# Altium schematic sheet 1 Power.SchDoc: Power
size A3; PageSetup: Record=PageOptions|CenterHorizontal=True|CenterVertical=True|PrintScale=1.01|XCorrection=1.00|YCorrection=1.00|PrintKind=2|BorderSize=5000000|LeftOffset=0|BottomOffset=0|Orientation=2|PaperLength=1000|PaperWidth=1000|Scale=100|PaperSource=15|PrintQuality=600|MediaType=1|DitherType=10|PaperKind=A3|PrintScaleMode=1; DocumentNumber: 4; SheetNumber: 2; SheetTotal: 7
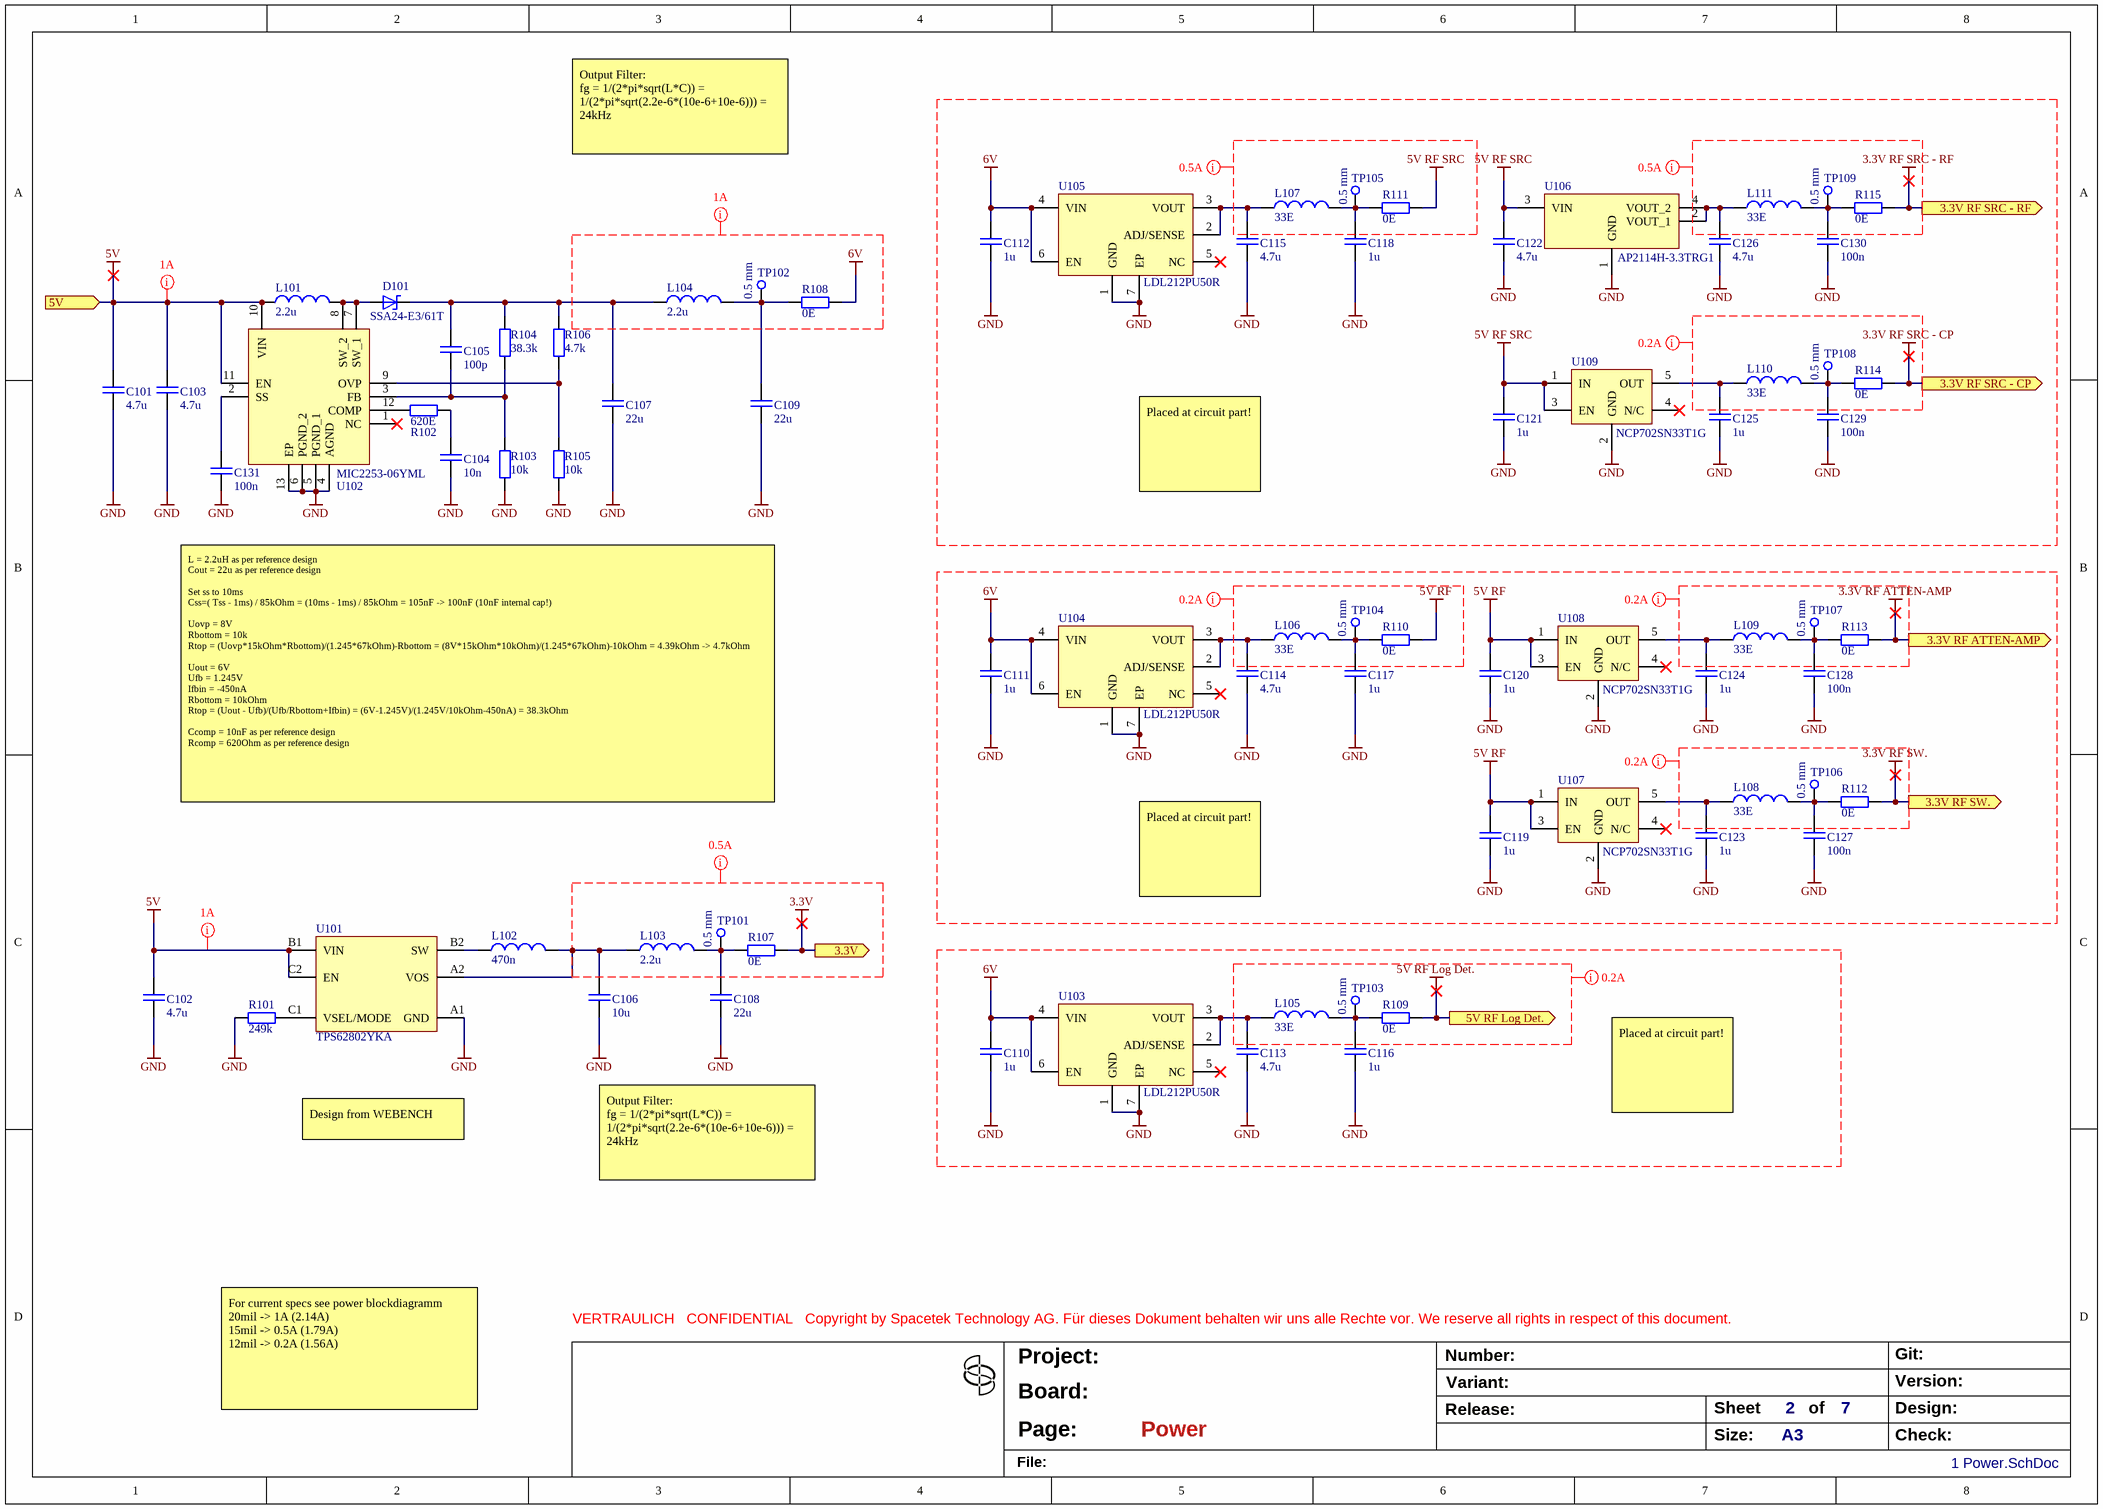
[diagram p0: 1 Power.SchDoc]

## Parts
C101  4.7u  [STT--CC--0805]
C102  4.7u  [STT--CC--0805]
C103  4.7u  [STT--CC--0805]
C104  10n  [STT--CC--0603]
C105  100p  [STT--CC--0402]
C106  10u  [STT--CC--0603]
C107  22u  [STT--CC--0805]
C108  22u  [STT--CC--0805]
C109  22u  [STT--CC--0805]
C110  1u  [STT--CC--0603]
C111  1u  [STT--CC--0603]
C112  1u  [STT--CC--0603]
C113  4.7u  [STT--CC--0805]
C114  4.7u  [STT--CC--0805]
C115  4.7u  [STT--CC--0805]
C116  1u  [STT--CC--0603]
C117  1u  [STT--CC--0603]
C118  1u  [STT--CC--0603]
C119  1u  [STT--CC--0603]
C120  1u  [STT--CC--0603]
C121  1u  [STT--CC--0603]
C122  4.7u  [STT--CC--0805]
C123  1u  [STT--CC--0603]
C124  1u  [STT--CC--0603]
C125  1u  [STT--CC--0603]
C126  4.7u  [STT--CC--0805]
C127  100n  [STT--CC--0402]
C128  100n  [STT--CC--0402]
C129  100n  [STT--CC--0402]
C130  100n  [STT--CC--0402]
C131  100n  [STT--CC--0402]
D101  SSA24-E3/61T  [STT--SD--SMA-DO-214AC]
L101  2.2u  [BOU--LF--SRP4020FA]
L102  470n  [MUR--FB--DFE252012F]
L103  2.2u  [BOU--LF--SRP4020FA]
L104  2.2u  [BOU--LF--SRP4020FA]
L105  33E  [STT--FB--0402]
L106  33E  [STT--FB--0402]
L107  33E  [STT--FB--0402]
L108  33E  [STT--FB--0402]
L109  33E  [STT--FB--0402]
L110  33E  [STT--FB--0402]
L111  33E  [STT--FB--0402]
R101  249k  [STT--RC--0603]
R102  620E  [STT--RC--0603]
R103  10k  [STT--RC--0603]
R104  38.3k  [STT--RC--0603]
R105  10k  [STT--RC--0603]
R106  4.7k  [STT--RC--0603]
R107  0E  [STT--RC--0603]
R108  0E  [STT--RC--0603]
R109  0E  [STT--RC--0603]
R110  0E  [STT--RC--0603]
R111  0E  [STT--RC--0603]
R112  0E  [STT--RC--0603]
R113  0E  [STT--RC--0603]
R114  0E  [STT--RC--0603]
R115  0E  [STT--RC--0603]
TP101  0.5 mm  [STT--DO--TP-0.5]  (no BOM)
TP102  0.5 mm  [STT--DO--TP-0.5]  (no BOM)
TP103  0.5 mm  [STT--DO--TP-0.5]  (no BOM)
TP104  0.5 mm  [STT--DO--TP-0.5]  (no BOM)
TP105  0.5 mm  [STT--DO--TP-0.5]  (no BOM)
TP106  0.5 mm  [STT--DO--TP-0.5]  (no BOM)
TP107  0.5 mm  [STT--DO--TP-0.5]  (no BOM)
TP108  0.5 mm  [STT--DO--TP-0.5]  (no BOM)
TP109  0.5 mm  [STT--DO--TP-0.5]  (no BOM)
U101  TPS62802YKA  [TEI--IC--BGA6]
U102  MIC2253-06YML  [MC--IC--SON50P300X300X90-13N-D]
U103  LDL212PU50R  [STM--IC--DFN-6]
U104  LDL212PU50R  [STM--IC--DFN-6]
U105  LDL212PU50R  [STM--IC--DFN-6]
U106  AP2114H-3.3TRG1  [DI--IC--SOT-223-3]
U107  NCP702SN33T1G  [ON--IC--SOT-23-5]
U108  NCP702SN33T1G  [ON--IC--SOT-23-5]
U109  NCP702SN33T1G  [ON--IC--SOT-23-5]

## Ports
3.3V (out), 3.3V RF ATTEN-AMP (out), 3.3V RF SRC - CP (out), 3.3V RF SRC - RF (out), 3.3V RF SW. (out), 5V (in), 5V RF Log Det. (out)

## Nets
3.3V: R107.2 ; port 3.3V
3.3V RF ATTEN-AMP: R113.2 ; port 3.3V RF ATTEN-AMP
3.3V RF SRC - CP: R114.2 ; port 3.3V RF SRC - CP
3.3V RF SRC - RF: R115.2 ; port 3.3V RF SRC - RF
3.3V RF SW.: R112.2 ; port 3.3V RF SW.
5V: C101.2 C102.2 C103.2 L101.1 U101.B1(VIN) U101.C2(EN) U102.10(VIN) U102.11(EN) ; port 5V
5V RF: C119.2 C120.2 R110.2 U107.1(IN) U107.3(EN) U108.1(IN) U108.3(EN)
5V RF Log Det.: R109.2 ; port 5V RF Log Det.
5V RF SRC: C121.2 C122.2 R111.2 U106.3(VIN) U109.1(IN) U109.3(EN)
6V: C110.2 C111.2 C112.2 R108.2 U103.4(VIN) U103.6(EN) U104.4(VIN) U104.6(EN) U105.4(VIN) U105.6(EN)
GND: C101.1 C102.1 C103.1 C104.1 C106.1 C107.1 C108.1 C109.1 C110.1 C111.1 C112.1 C113.1 C114.1 C115.1 C116.1 C117.1 C118.1 C119.1 C120.1 C121.1 C122.1 C123.1 C124.1 C125.1 C126.1 C127.1 C128.1 C129.1 C130.1 C131.1 R101.2 R103.1 R105.1 U101.A1(GND) U102.4(AGND) U102.5(PGND_1) U102.6(PGND_2) U102.13(EP) U103.1(GND) U103.7(EP) U104.1(GND) U104.7(EP) U105.1(GND) U105.7(EP) U106.1(GND) U107.2(GND) U108.2(GND) U109.2(GND)
NetC104_2: C104.2 R102.1
NetC105_1: C105.1 R103.2 R104.1 U102.3(FB)
NetC105_2: C105.2 C107.2 D101.2(K) L104.1 R104.2 R106.2
NetC106_2: C106.2 L102.2 L103.1 U101.A2(VOS)
NetC108_2: C108.2 L103.2 R107.1 TP101.1
NetC109_2: C109.2 L104.2 R108.1 TP102.1
NetC113_2: C113.2 L105.1 U103.2(ADJ/SENSE) U103.3(VOUT)
NetC114_2: C114.2 L106.1 U104.2(ADJ/SENSE) U104.3(VOUT)
NetC115_2: C115.2 L107.1 U105.2(ADJ/SENSE) U105.3(VOUT)
NetC116_2: C116.2 L105.2 R109.1 TP103.1
NetC117_2: C117.2 L106.2 R110.1 TP104.1
NetC118_2: C118.2 L107.2 R111.1 TP105.1
NetC123_2: C123.2 L108.1 U107.5(OUT)
NetC124_2: C124.2 L109.1 U108.5(OUT)
NetC125_2: C125.2 L110.1 U109.5(OUT)
NetC126_2: C126.2 L111.1 U106.2(VOUT_1) U106.4(VOUT_2)
NetC127_2: C127.2 L108.2 R112.1 TP106.1
NetC128_2: C128.2 L109.2 R113.1 TP107.1
NetC129_2: C129.2 L110.2 R114.1 TP108.1
NetC130_2: C130.2 L111.2 R115.1 TP109.1
NetC131_2: C131.2 U102.2(SS)
NetD101_1: D101.1(A) L101.2 U102.7(SW_1) U102.8(SW_2)
NetL102_1: L102.1 U101.B2(SW)
NetR101_1: R101.1 U101.C1(VSEL/MODE)
NetR102_2: R102.2 U102.12(COMP)
NetR105_2: R105.2 R106.1 U102.9(OVP)

Not connected (* = marked no-connect by the designer): U102 1(NC)*; U103 5(NC)*; U104 5(NC)*; U105 5(NC)*; U107 4(N/C)*; U108 4(N/C)*; U109 4(N/C)*

## Layout directives
net class 1A: 5V, 6V
net class 0.5A: 3.3V, 3.3V RF SRC - RF, 5V RF SRC
net class 0.2A: 3.3V RF ATTEN-AMP, 3.3V RF SRC - CP, 3.3V RF SW., 5V RF, 5V RF Log Det.

## Notes on the sheet
- Output Filter:
  fg = 1/(2*pi*sqrt(L*C)) = 1/(2*pi*sqrt(2.2e-6*(10e-6+10e-6))) = 24kHz
- Placed at circuit part!
- L = 2.2uH as per reference design
  Cout = 22u as per reference design
  Set ss to 10ms
  Css=( Tss - 1ms) / 85kOhm = (10ms - 1ms) / 85kOhm = 105nF -> 100nF (10nF internal cap!)
  Uovp = 8V
  Rbottom = 10k
  Rtop = (Uovp*15kOhm*Rbottom)/(1.245*67kOhm)-Rbottom = (8V*15kOhm*10kOhm)/(1.245*67kOhm)-10kOhm = 4.39kOhm -> 4.7kOhm
  Uout = 6V
  Ufb = 1.245V
  Ifbin = -450nA
  Rbottom = 10kOhm
  Rtop = (Uout - Ufb)/(Ufb/Rbottom+Ifbin) = (6V-1.245V)/(1.245V/10kOhm-450nA) = 38.3kOhm
  Ccomp = 10nF as per reference design
  Rcomp = 620Ohm as per reference design
- Design from WEBENCH
- For current specs see power blockdiagramm
  20mil -> 1A (2.14A)
  15mil -> 0.5A (1.79A)
  12mil -> 0.2A (1.56A)
- VERTRAULICH   CONFIDENTIAL   Copyright by Spacetek Technology AG. Für dieses Dokument behalten wir uns alle Rechte vor. We reserve all rights in respect of this document.
- Project:
- Number:
- Variant:
- Version:
- Git:
- Board:
- Page:
- Release:
- Size:
- Sheet
- A3
- of
- Design:
- Check:
- File:

## Library data of the parts
C101-C103 C113-C115 C122 C126 = 200017-1: Capacitor ceramic 4.7u 25V 10% X7R  SMD--0805; Manufacturer: Samsung Electro-Mechanics; Partnumber: CL21B475KAFNNNE; A-Number: 200017; Value: 4.7u; Package: SMD--0805; Tolerance: 10%; Material: X7R; Status: released; Type: Capacitor ceramic; Voltage: 25V
C104 = CMP-010-000027-1: Capacitor ceramic 10n 50V 5% C0G/NPO  SMD--0603; Partnumber: GRM1885C1H103JA01D; Manufacturer: Murata Electronics; Family Code: 1; Group Code: 2; A-Number: TBD; Tolerance: +/-5%; preferred: Yes; Generic Specification: COTS; Type: Capacitor ceramic; Package: SMD--0603; Voltage: 50V; Material: C0G/NPO; Status: active; Value: 10n
C105 = CMP-010-000109-1: Capacitor ceramic 100p 50V 5% C0G AEC-Q200 SMD--0402; Partnumber: CL05C101JB51PND; Manufacturer: Samsung Electro-Mechanics; Component Category: Generic; Meta Data Version: v1.0; Package: SMD--0402; Status: released; Type: Capacitor ceramic; Value: 100p
C106 = CMP-010-000008-3: Capacitor ceramic 10u 25V 20% X5R  SMD--0603; Partnumber: GRM188R61E106MA73D; Manufacturer: Murata Electronics; Generic Specification: COTS; A-Number: 200041; Family Code: 1; Group Code: 2; Type: Capacitor ceramic; Tolerance: 20%; Status: released; Material: X5R; Value: 10u; Voltage: 25V; Package: SMD--0603
C107-C109 = CMP-010-000114-1: Capacitor ceramic 22u 25V 20% X5R  SMD--0805; Manufacturer: TAIYO YUDEN; Partnumber: MSAST21GBB5226MTNC12; Meta Data Version: v1.0; Component Category: generic; Voltage: 25V; Value: 22u; Type: Capacitor ceramic; Package: SMD--0805; Tolerance: 20%; Status: released; Material: X5R
C110-C112 C116-C121 C123-C125 = CMP-010-000042-2: CAP CER 1UF 35V X7R 0603 10%; Manufacturer: TDK Corporation; Partnumber: C1608X7R1V105K080AC; Special: 0603 SMD; Value: 1u; E-Nummer: -; Status: released
C127-C131 = 200032-3: Capacitor ceramic 100n 16V 10% X7R  SMD--0402; Partnumber: CL05B104KO5NNNC; Manufacturer: Samsung Electro-Mechanics; A-Number: 200032; Material: X7R; Voltage: 16V; Type: Capacitor ceramic; Tolerance: 10%; Status: released; Package: SMD--0402; Value: 100n
D101 = CMP-039-000054-1: Schottky Diode SSA24-E3/61T 40V 2A; Manufacturer: Vishay; Meta Data Version: v1.0; Component Category: generic; Current: 2A; Partnumber: SSA24-E3/61T; Status: released; Voltage: 40V; Type: Schottky Diode; Value: SSA24-E3/61T
L101 L103 L104 = 300008-1: Inductor SRP4020FA-2R2M 2.2u 3.1A 21.35mR 38MHz SMD--SRP4020FA; Manufacturer: Bourns; A-Number: 300008; preferred: yes; Type: Inductor; Value: 2.2u; Current: 3.1A; Special: 21.35mR 38MHz; Partnumber: SRP4020FA-2R2M; Status: active; Package: SRP4020FA-2R2M
L102 = 300013-1: Inductor DFE252012F-R47M=P2 470n 7.4A 17mR  SMD--2520; Manufacturer: Murata Electronics; preferred: yes; A-Number: 300013; Value: 470n; Type: Inductor; Current: 7.4A; Partnumber: DFE252012F-R47M=P2; Package: DFE252012F-R47M=P2; Special: 17mR; Status: active
L105-L111 = 300015-1: Ferrit Bead MPZ1005S330HT000 33E 3A 22mE SMD--0402; Manufacturer: TDK Group; preferred: Yes; A-Number: 300015; Status: active; Current: 3A; Type: Ferrit Bead; Value: 33E; Package: MPZ1005S330HT000; Special: 22mE; Partnumber: MPZ1005S330HT000
R101 = CMP-009-000253-1: Resistor 249k 75V 0.1W 0.1% SMD--0603; Manufacturer: YAGEO; Partnumber: RT0603BRD07249KL; Meta Data Version: v1.0; Component Category: generic; Tolerance: 0.1%; Value: 249k; Package: SMD--0603; Status: released; Power: 0.1W; Type: Resistor
R102 = CMP-009-000254-1: Resistor 620E 75V  0.1W 0.1% ±25ppm/°C SMD--0603; Manufacturer: Yageo; Partnumber: RT0603FRE07620RL; Special: ±50ppm/°C; Meta Data Version: v1.0; Tolerance: 1%; Component Category: generic; Type: Resistor; Value: 620E; Status: released; Package: SMD--0603; Voltage: 75V; Power: 0.1W
R103 R105 = 100072-3: Resistor 10k 75V  0.1W 0.1% 25ppm SMD--0603; Manufacturer: Susumu; Partnumber: RG1608P-103-B-T5; Generic Specification: COTS; Group Code: 9; A-Number: 100072; Family Code: 10; preferred: yes; Value: 10k; Type: Resistor; Power: 0.1W; Tolerance: 0.1%; Status: active; Special: 25ppm; Voltage: 75V; Package: SMD--0603
R104 = CMP-009-000255-1: Resistor 38.3k 75V  0.1W 0.1%  SMD--0603; Partnumber: RT0603BRD0738K3L; Manufacturer: Yageo; Meta Data Version: v1.0; Component Category: generic; Type: Resistor; Status: released; Value: 38.3k; Package: SMD--0603; Voltage: 75V
R106 = 100023-3: Resistor 4.7k 75V  0.1W 1%  SMD--0603; A-Number: 100023; Group Code: 9; Family Code: 10; preferred: no; Generic Specification: COTS; Tolerance: 1%; Voltage: 75V; Package: SMD--0603; Power: 0.1W; Type: Resistor; Status: obsolete; Value: 4.7k
R107-R115 = 100055-3: Resistor 0E 75V  0.125W   SMD--0603; Manufacturer: Vishay; Partnumber: MCT06030Z0000ZP500; Family Code: 10; Group Code: 9; A-Number: 100055; preferred: yes; Generic Specification: COTS; Package: SMD--0603; Value: 0E; Status: active; Power: 0.125W; Voltage: 75V; Type: Resistor
TP101-TP109 = CMP-043-000000-4: Pad TP SMD--Pad 0.5; Special: 0.5; preferred: Yes; Status: active; Partnumber: TP; Value: 0.5 mm; Package: SMD--Pad; Type: Pad
U101 = CMP-091-000047-3: DCDC Buck Converter 1.75-V to 5.5-V input 1-A ultra-low IQ; Manufacturer: Texas Instruments; Component Category: generic; Meta Data Version: v1.0; Partnumber: TPS62802YKA; Status: released; Value: TPS62802YKA
U102 = CMP-091-000046-2: Switching Voltage Regulators 3.5A 1MHz High Efficiency Boost Regulator with OVP & Softstart; Manufacturer: Microchip; Component Category: generic; Meta Data Version: v1.0; Value: MIC2253-06YML; Status: released; Partnumber: MIC2253-06YML
U103-U105 = CMP-091-000048-1: LDO 1.2A Low Drop Linear Regulator IC; Manufacturer: STMicroelectronics; Meta Data Version: v1.0; Component Category: generic; Partnumber: LDL212PU50R; Status: released; Value: LDL212PU50R
U106 = CMP-091-000049-1: LDO 3.3V Fixed 1A Low Noise CMOS LDO Regulator With Enable; Manufacturer: Diodes Incoporated; Meta Data Version: v1.0; Component Category: generic; Partnumber: AP2114H-3.3TRG1; Value: AP2114H-3.3TRG1; Status: released
U107-U109 = CMP-091-000050-1: LDO 3.3V Fixed 200 mA; Manufacturer: onsemi; Component Category: generic; Meta Data Version: v1.0; Value: NCP702SN33T1G; Status: released; Partnumber: NCP702SN33T1G